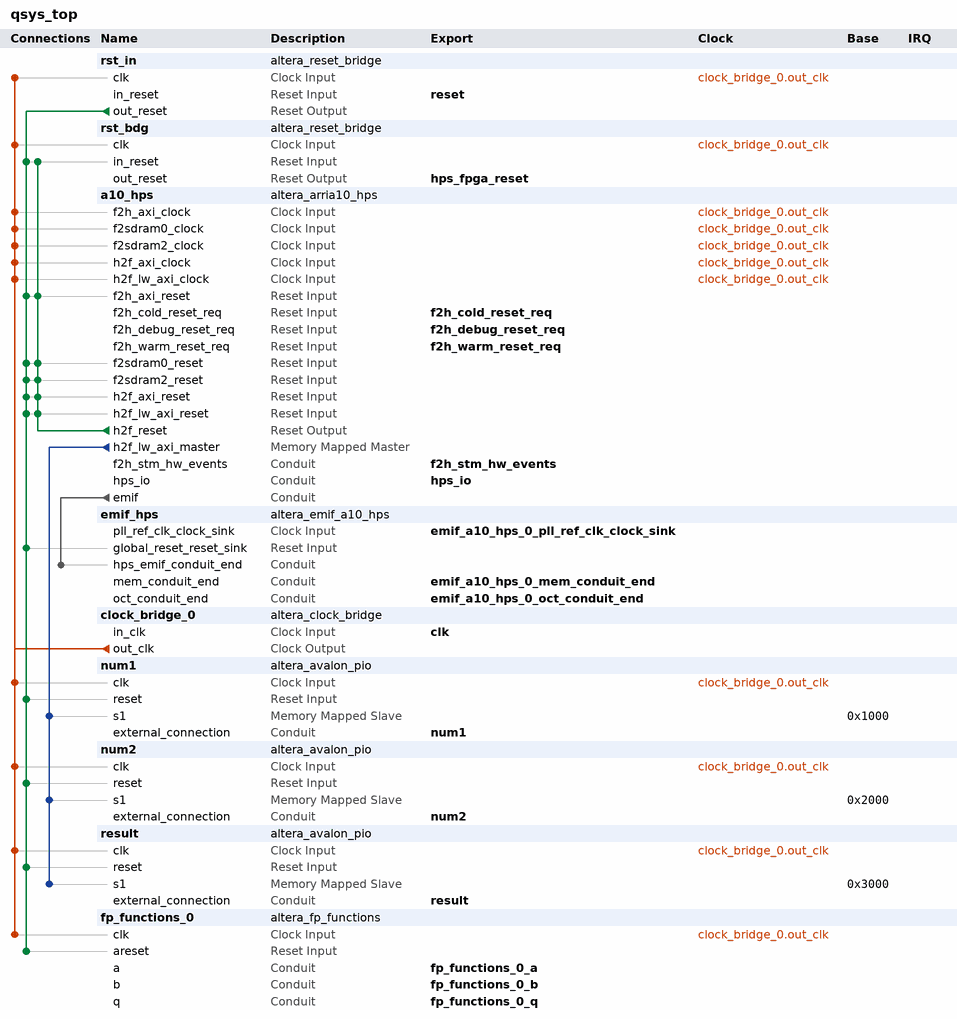
[diagram p0: system contents]
# Platform Designer (Qsys) system qsys_top, Arria 10 10AS066N3F40E2SG
# Parameters at their usual value, and those the tool derives, are not listed.
package require -exact qsys 1.0
create_system qsys_top
set_project_property DEVICE_FAMILY {Arria 10}
set_project_property DEVICE 10AS066N3F40E2SG

add_component rst_in ip/qsys_top/rst_in.ip altera_reset_bridge rst_in 18.1
load_component rst_in
set_component_parameter_value ACTIVE_LOW_RESET 1
set_component_parameter_value SYNCHRONOUS_EDGES deassert
set_component_parameter_value SYNC_RESET 0
save_component

add_component rst_bdg ip/qsys_top/rst_bdg.ip altera_reset_bridge rst_bdg 18.1

add_instance a10_hps altera_arria10_hps 18.1
set_instance_parameter_value a10_hps BOOT_FROM_FPGA_Enable false
set_instance_parameter_value a10_hps BSEL 1
set_instance_parameter_value a10_hps BSEL_EN false
set_instance_parameter_value a10_hps CLK_EMACA_SOURCE 1
set_instance_parameter_value a10_hps CLK_EMACB_SOURCE 1
set_instance_parameter_value a10_hps CLK_EMAC_PTP_SOURCE 1
set_instance_parameter_value a10_hps CLK_GPIO_SOURCE 1
set_instance_parameter_value a10_hps CLK_HMC_PLL_SOURCE 0
set_instance_parameter_value a10_hps CLK_MAIN_PLL_SOURCE2 0
set_instance_parameter_value a10_hps CLK_MPU_CNT 0
set_instance_parameter_value a10_hps CLK_MPU_SOURCE 0
set_instance_parameter_value a10_hps CLK_NOC_CNT 0
set_instance_parameter_value a10_hps CLK_NOC_SOURCE 0
set_instance_parameter_value a10_hps CLK_PERI_PLL_SOURCE2 0
set_instance_parameter_value a10_hps CLK_S2F_USER0_SOURCE 0
set_instance_parameter_value a10_hps CLK_S2F_USER1_SOURCE 0
set_instance_parameter_value a10_hps CLK_SDMMC_SOURCE 1
set_instance_parameter_value a10_hps CM_Mode N/A
set_instance_parameter_value a10_hps CM_PinMuxing Unused
set_instance_parameter_value a10_hps CTI_Enable false
set_instance_parameter_value a10_hps CUSTOM_MPU_CLK 1020
set_instance_parameter_value a10_hps DEBUG_APB_Enable false
set_instance_parameter_value a10_hps DISABLE_PERI_PLL false
set_instance_parameter_value a10_hps DMA_Enable No,No,No,No,No,No,No,No
set_instance_parameter_value a10_hps EMAC0_CLK 250
set_instance_parameter_value a10_hps EMAC0_Mode RGMII_with_MDIO
set_instance_parameter_value a10_hps EMAC0_PTP false
set_instance_parameter_value a10_hps EMAC0_PinMuxing IO
set_instance_parameter_value a10_hps EMAC0_SWITCH_Enable false
set_instance_parameter_value a10_hps EMAC1_CLK 250
set_instance_parameter_value a10_hps EMAC1_Mode N/A
set_instance_parameter_value a10_hps EMAC1_PTP false
set_instance_parameter_value a10_hps EMAC1_PinMuxing Unused
set_instance_parameter_value a10_hps EMAC1_SWITCH_Enable false
set_instance_parameter_value a10_hps EMAC2_CLK 250
set_instance_parameter_value a10_hps EMAC2_Mode N/A
set_instance_parameter_value a10_hps EMAC2_PTP false
set_instance_parameter_value a10_hps EMAC2_PinMuxing Unused
set_instance_parameter_value a10_hps EMAC2_SWITCH_Enable false
set_instance_parameter_value a10_hps EMAC_PTP_REF_CLK 100
set_instance_parameter_value a10_hps EMIF_BYPASS_CHECK false
set_instance_parameter_value a10_hps EMIF_CONDUIT_Enable true
set_instance_parameter_value a10_hps F2H_AXI_CLOCK_FREQ 150000000
set_instance_parameter_value a10_hps F2H_COLD_RST_Enable true
set_instance_parameter_value a10_hps F2H_DBG_RST_Enable true
set_instance_parameter_value a10_hps F2H_DELAY 3
set_instance_parameter_value a10_hps F2H_FREE_CLK_Enable false
set_instance_parameter_value a10_hps F2H_FREE_CLK_FREQ 200
set_instance_parameter_value a10_hps F2H_SDRAM0_CLOCK_FREQ 100
set_instance_parameter_value a10_hps F2H_SDRAM1_CLOCK_FREQ 100
set_instance_parameter_value a10_hps F2H_SDRAM2_CLOCK_FREQ 100
set_instance_parameter_value a10_hps F2H_SDRAM3_CLOCK_FREQ 100
set_instance_parameter_value a10_hps F2H_SDRAM4_CLOCK_FREQ 100
set_instance_parameter_value a10_hps F2H_SDRAM5_CLOCK_FREQ 100
set_instance_parameter_value a10_hps F2H_WARM_RST_Enable true
set_instance_parameter_value a10_hps F2SDRAM0_ENABLED true
set_instance_parameter_value a10_hps F2SDRAM1_ENABLED false
set_instance_parameter_value a10_hps F2SDRAM2_DELAY 4
set_instance_parameter_value a10_hps F2SDRAM2_ENABLED true
set_instance_parameter_value a10_hps F2SDRAM_ADDRESS_WIDTH 32
set_instance_parameter_value a10_hps F2SDRAM_PORT_CONFIG 6
set_instance_parameter_value a10_hps F2SDRAM_READY_LATENCY true
set_instance_parameter_value a10_hps F2SINTERRUPT_Enable true
set_instance_parameter_value a10_hps F2S_Width 6
set_instance_parameter_value a10_hps FPGA_PERIPHERAL_INPUT_CLOCK_FREQ_EMAC0_RX_CLK_IN 100
set_instance_parameter_value a10_hps FPGA_PERIPHERAL_INPUT_CLOCK_FREQ_EMAC0_TX_CLK_IN 100
set_instance_parameter_value a10_hps FPGA_PERIPHERAL_INPUT_CLOCK_FREQ_EMAC1_RX_CLK_IN 100
set_instance_parameter_value a10_hps FPGA_PERIPHERAL_INPUT_CLOCK_FREQ_EMAC1_TX_CLK_IN 100
set_instance_parameter_value a10_hps FPGA_PERIPHERAL_INPUT_CLOCK_FREQ_EMAC2_RX_CLK_IN 100
set_instance_parameter_value a10_hps FPGA_PERIPHERAL_INPUT_CLOCK_FREQ_EMAC2_TX_CLK_IN 100
set_instance_parameter_value a10_hps FPGA_PERIPHERAL_INPUT_CLOCK_FREQ_EMAC_PTP_REF_CLOCK 100
set_instance_parameter_value a10_hps FPGA_PERIPHERAL_INPUT_CLOCK_FREQ_I2C0_SCL_IN 100
set_instance_parameter_value a10_hps FPGA_PERIPHERAL_INPUT_CLOCK_FREQ_I2C1_SCL_IN 100
set_instance_parameter_value a10_hps FPGA_PERIPHERAL_INPUT_CLOCK_FREQ_I2CEMAC0_SCL_IN 100
set_instance_parameter_value a10_hps FPGA_PERIPHERAL_INPUT_CLOCK_FREQ_I2CEMAC1_SCL_IN 100
set_instance_parameter_value a10_hps FPGA_PERIPHERAL_INPUT_CLOCK_FREQ_I2CEMAC2_SCL_IN 100
set_instance_parameter_value a10_hps FPGA_PERIPHERAL_INPUT_CLOCK_FREQ_SDMMC_CLK_IN 100
set_instance_parameter_value a10_hps FPGA_PERIPHERAL_INPUT_CLOCK_FREQ_SPIS0_SCLK_IN 100
set_instance_parameter_value a10_hps FPGA_PERIPHERAL_INPUT_CLOCK_FREQ_SPIS1_SCLK_IN 100
set_instance_parameter_value a10_hps FPGA_PERIPHERAL_INPUT_CLOCK_FREQ_USB0_CLK_IN 100
set_instance_parameter_value a10_hps FPGA_PERIPHERAL_INPUT_CLOCK_FREQ_USB1_CLK_IN 100
set_instance_parameter_value a10_hps FPGA_PERIPHERAL_OUTPUT_CLOCK_FREQ_EMAC0_GTX_CLK 100
set_instance_parameter_value a10_hps FPGA_PERIPHERAL_OUTPUT_CLOCK_FREQ_EMAC0_MD_CLK 2.5
set_instance_parameter_value a10_hps FPGA_PERIPHERAL_OUTPUT_CLOCK_FREQ_EMAC1_GTX_CLK 125
set_instance_parameter_value a10_hps FPGA_PERIPHERAL_OUTPUT_CLOCK_FREQ_EMAC1_MD_CLK 2.5
set_instance_parameter_value a10_hps FPGA_PERIPHERAL_OUTPUT_CLOCK_FREQ_EMAC2_GTX_CLK 125
set_instance_parameter_value a10_hps FPGA_PERIPHERAL_OUTPUT_CLOCK_FREQ_EMAC2_MD_CLK 2.5
set_instance_parameter_value a10_hps FPGA_PERIPHERAL_OUTPUT_CLOCK_FREQ_I2C0_CLK 100
set_instance_parameter_value a10_hps FPGA_PERIPHERAL_OUTPUT_CLOCK_FREQ_I2C1_CLK 100
set_instance_parameter_value a10_hps FPGA_PERIPHERAL_OUTPUT_CLOCK_FREQ_I2CEMAC0_CLK 100
set_instance_parameter_value a10_hps FPGA_PERIPHERAL_OUTPUT_CLOCK_FREQ_I2CEMAC1_CLK 100
set_instance_parameter_value a10_hps FPGA_PERIPHERAL_OUTPUT_CLOCK_FREQ_I2CEMAC2_CLK 100
set_instance_parameter_value a10_hps FPGA_PERIPHERAL_OUTPUT_CLOCK_FREQ_QSPI_SCLK_OUT 100
set_instance_parameter_value a10_hps FPGA_PERIPHERAL_OUTPUT_CLOCK_FREQ_SDMMC_CCLK 100
set_instance_parameter_value a10_hps FPGA_PERIPHERAL_OUTPUT_CLOCK_FREQ_SPIM0_SCLK_OUT 100
set_instance_parameter_value a10_hps FPGA_PERIPHERAL_OUTPUT_CLOCK_FREQ_SPIM1_SCLK_OUT 100
set_instance_parameter_value a10_hps GPIO_REF_CLK 4
set_instance_parameter_value a10_hps GP_Enable false
set_instance_parameter_value a10_hps H2F_AXI_CLOCK_FREQ 150000000
set_instance_parameter_value a10_hps H2F_COLD_RST_Enable false
set_instance_parameter_value a10_hps H2F_CTI_CLOCK_FREQ 100
set_instance_parameter_value a10_hps H2F_DEBUG_APB_CLOCK_FREQ 100
set_instance_parameter_value a10_hps H2F_DELAY 3
set_instance_parameter_value a10_hps H2F_LW_AXI_CLOCK_FREQ 150000000
set_instance_parameter_value a10_hps H2F_LW_DELAY 3
set_instance_parameter_value a10_hps H2F_PENDING_RST_Enable false
set_instance_parameter_value a10_hps H2F_TPIU_CLOCK_IN_FREQ 100
set_instance_parameter_value a10_hps H2F_USER0_CLK_Enable false
set_instance_parameter_value a10_hps H2F_USER0_CLK_FREQ 400
set_instance_parameter_value a10_hps H2F_USER1_CLK_Enable false
set_instance_parameter_value a10_hps H2F_USER1_CLK_FREQ 400
set_instance_parameter_value a10_hps HMC_PLL_REF_CLK 800
set_instance_parameter_value a10_hps HPS_DIV_GPIO_FREQ 125
set_instance_parameter_value a10_hps HPS_IO_Enable SDMMC:D0,SDMMC:CMD,SDMMC:CCLK,SDMMC:D1,SDMMC:D2,SDMMC:D3,NONE,NONE,SDMMC:D4,SDMMC:D5,SDMMC:D6,SDMMC:D7,UART1:TX,UART1:RX,USB0:CLK,USB0:STP,USB0:DIR,USB0:DATA0,USB0:DATA1,USB0:NXT,USB0:DATA2,USB0:DATA3,USB0:DATA4,USB0:DATA5,USB0:DATA6,USB0:DATA7,EMAC0:TX_CLK,EMAC0:TX_CTL,EMAC0:RX_CLK,EMAC0:RX_CTL,EMAC0:TXD0,EMAC0:TXD1,EMAC0:RXD0,EMAC0:RXD1,EMAC0:TXD2,EMAC0:TXD3,EMAC0:RXD2,EMAC0:RXD3,SPIM1:CLK,SPIM1:MOSI,SPIM1:MISO,SPIM1:SS0_N,SPIM1:SS1_N,GPIO,NONE,NONE,NONE,NONE,MDIO0:MDIO,MDIO0:MDC,I2C1:SDA,I2C1:SCL,GPIO,TRACE:CLK,GPIO,GPIO,NONE,NONE,TRACE:D0,TRACE:D1,TRACE:D2,TRACE:D3
set_instance_parameter_value a10_hps I2C0_Mode N/A
set_instance_parameter_value a10_hps I2C0_PinMuxing Unused
set_instance_parameter_value a10_hps I2C1_Mode default
set_instance_parameter_value a10_hps I2C1_PinMuxing IO
set_instance_parameter_value a10_hps I2CEMAC0_Mode N/A
set_instance_parameter_value a10_hps I2CEMAC0_PinMuxing Unused
set_instance_parameter_value a10_hps I2CEMAC1_Mode N/A
set_instance_parameter_value a10_hps I2CEMAC1_PinMuxing Unused
set_instance_parameter_value a10_hps I2CEMAC2_Mode N/A
set_instance_parameter_value a10_hps I2CEMAC2_PinMuxing Unused
set_instance_parameter_value a10_hps INTERNAL_OSCILLATOR_ENABLE 60
set_instance_parameter_value a10_hps JTAG_Enable false
set_instance_parameter_value a10_hps L3_MAIN_FREE_CLK 200
set_instance_parameter_value a10_hps L4_SYS_FREE_CLK 1
set_instance_parameter_value a10_hps LWH2F_Enable 2
set_instance_parameter_value a10_hps MPU_CLK_VCCL 1
set_instance_parameter_value a10_hps MPU_EVENTS_Enable false
set_instance_parameter_value a10_hps NAND_Mode N/A
set_instance_parameter_value a10_hps NAND_PinMuxing Unused
set_instance_parameter_value a10_hps NOCDIV_CS_ATCLK 0
set_instance_parameter_value a10_hps NOCDIV_CS_PDBGCLK 1
set_instance_parameter_value a10_hps NOCDIV_CS_TRACECLK 1
set_instance_parameter_value a10_hps NOCDIV_L4MAINCLK 0
set_instance_parameter_value a10_hps NOCDIV_L4MPCLK 0
set_instance_parameter_value a10_hps NOCDIV_L4SPCLK 2
set_instance_parameter_value a10_hps OVERIDE_PERI_PLL false
set_instance_parameter_value a10_hps PERI_PLL_MANUAL_VCO_FREQ 2000
set_instance_parameter_value a10_hps PLL_CLK0 Unused
set_instance_parameter_value a10_hps PLL_CLK1 Unused
set_instance_parameter_value a10_hps PLL_CLK2 Unused
set_instance_parameter_value a10_hps PLL_CLK3 Unused
set_instance_parameter_value a10_hps PLL_CLK4 Unused
set_instance_parameter_value a10_hps QSPI_Mode N/A
set_instance_parameter_value a10_hps QSPI_PinMuxing Unused
set_instance_parameter_value a10_hps RUN_INTERNAL_BUILD_CHECKS 0
set_instance_parameter_value a10_hps S2FINTERRUPT_CLOCKPERIPHERAL_Enable false
set_instance_parameter_value a10_hps S2FINTERRUPT_CTI_Enable false
set_instance_parameter_value a10_hps S2FINTERRUPT_DMA_Enable false
set_instance_parameter_value a10_hps S2FINTERRUPT_EMAC0_Enable false
set_instance_parameter_value a10_hps S2FINTERRUPT_EMAC1_Enable false
set_instance_parameter_value a10_hps S2FINTERRUPT_EMAC2_Enable false
set_instance_parameter_value a10_hps S2FINTERRUPT_FPGAMANAGER_Enable false
set_instance_parameter_value a10_hps S2FINTERRUPT_GPIO_Enable false
set_instance_parameter_value a10_hps S2FINTERRUPT_HMC_Enable false
set_instance_parameter_value a10_hps S2FINTERRUPT_I2C0_Enable false
set_instance_parameter_value a10_hps S2FINTERRUPT_I2C1_Enable false
set_instance_parameter_value a10_hps S2FINTERRUPT_I2CEMAC0_Enable false
set_instance_parameter_value a10_hps S2FINTERRUPT_I2CEMAC1_Enable false
set_instance_parameter_value a10_hps S2FINTERRUPT_I2CEMAC2_Enable false
set_instance_parameter_value a10_hps S2FINTERRUPT_L4TIMER_Enable false
set_instance_parameter_value a10_hps S2FINTERRUPT_NAND_Enable false
set_instance_parameter_value a10_hps S2FINTERRUPT_QSPI_Enable false
set_instance_parameter_value a10_hps S2FINTERRUPT_SDMMC_Enable false
set_instance_parameter_value a10_hps S2FINTERRUPT_SPIM0_Enable false
set_instance_parameter_value a10_hps S2FINTERRUPT_SPIM1_Enable false
set_instance_parameter_value a10_hps S2FINTERRUPT_SPIS0_Enable false
set_instance_parameter_value a10_hps S2FINTERRUPT_SPIS1_Enable false
set_instance_parameter_value a10_hps S2FINTERRUPT_SYSTEMMANAGER_Enable false
set_instance_parameter_value a10_hps S2FINTERRUPT_SYSTIMER_Enable false
set_instance_parameter_value a10_hps S2FINTERRUPT_UART0_Enable false
set_instance_parameter_value a10_hps S2FINTERRUPT_UART1_Enable false
set_instance_parameter_value a10_hps S2FINTERRUPT_USB0_Enable false
set_instance_parameter_value a10_hps S2FINTERRUPT_USB1_Enable false
set_instance_parameter_value a10_hps S2FINTERRUPT_WATCHDOG_Enable false
set_instance_parameter_value a10_hps S2F_Width 4
set_instance_parameter_value a10_hps SDMMC_Mode 8-bit
set_instance_parameter_value a10_hps SDMMC_PinMuxing IO
set_instance_parameter_value a10_hps SDMMC_REF_CLK 200
set_instance_parameter_value a10_hps SECURITY_MODULE_Enable false
set_instance_parameter_value a10_hps SPIM0_Mode N/A
set_instance_parameter_value a10_hps SPIM0_PinMuxing Unused
set_instance_parameter_value a10_hps SPIM1_Mode Dual_slave_selects
set_instance_parameter_value a10_hps SPIM1_PinMuxing IO
set_instance_parameter_value a10_hps SPIS0_Mode N/A
set_instance_parameter_value a10_hps SPIS0_PinMuxing Unused
set_instance_parameter_value a10_hps SPIS1_Mode N/A
set_instance_parameter_value a10_hps SPIS1_PinMuxing Unused
set_instance_parameter_value a10_hps STM_Enable true
set_instance_parameter_value a10_hps TESTIOCTRL_DEBUGCLKSEL 16
set_instance_parameter_value a10_hps TESTIOCTRL_MAINCLKSEL 8
set_instance_parameter_value a10_hps TESTIOCTRL_PERICLKSEL 8
set_instance_parameter_value a10_hps TEST_Enable false
set_instance_parameter_value a10_hps TRACE_Mode default
set_instance_parameter_value a10_hps TRACE_PinMuxing IO
set_instance_parameter_value a10_hps UART0_Mode N/A
set_instance_parameter_value a10_hps UART0_PinMuxing Unused
set_instance_parameter_value a10_hps UART1_Mode No_flow_control
set_instance_parameter_value a10_hps UART1_PinMuxing IO
set_instance_parameter_value a10_hps USB0_Mode default
set_instance_parameter_value a10_hps USB0_PinMuxing IO
set_instance_parameter_value a10_hps USB1_Mode N/A
set_instance_parameter_value a10_hps USB1_PinMuxing Unused
set_instance_parameter_value a10_hps USE_DEFAULT_MPU_CLK false
set_instance_parameter_value a10_hps device_name 10AS066N3F40E2SG
set_instance_parameter_value a10_hps eosc1_clk_mhz 25.0
set_instance_parameter_value a10_hps quartus_ini_hps_ip_boot_from_fpga_ready false
set_instance_parameter_value a10_hps quartus_ini_hps_ip_enable_a10_advanced_options false
set_instance_parameter_value a10_hps quartus_ini_hps_ip_enable_jtag false
set_instance_parameter_value a10_hps quartus_ini_hps_ip_enable_sdmmc_clk_in false
set_instance_parameter_value a10_hps quartus_ini_hps_ip_enable_test_interface false
set_instance_parameter_value a10_hps quartus_ini_hps_ip_overide_f2sdram_delay false
set_instance_parameter_value a10_hps quartus_ini_hps_ip_override_sdmmc_4bit false

add_component emif_hps ip/qsys_top/emif_hps.ip altera_emif_a10_hps emif_hps 18.1

add_component clock_bridge_0 ip/qsys_top/qsys_top_clock_bridge_0.ip altera_clock_bridge clock_bridge_0 18.1

add_component num1 ip/qsys_top/num1.ip altera_avalon_pio num1 18.1
load_component num1
set_component_parameter_value direction Output
set_component_parameter_value width 32
save_component

add_component num2 ip/qsys_top/num1.ip altera_avalon_pio num2 18.1
load_component num2
set_component_parameter_value direction Output
set_component_parameter_value width 32
save_component

add_component result ip/qsys_top/result.ip altera_avalon_pio result 18.1

add_component fp_functions_0 ip/qsys_top/qsys_top_fp_functions_0.ip altera_fp_functions fp_functions_0 18.1
load_component fp_functions_0
set_component_parameter_value FUNCTION_FAMILY ARITH
set_component_parameter_value ARITH_function ADD
set_component_parameter_value CONVERT_function FXP_FP
set_component_parameter_value ALL_function ADD
set_component_parameter_value EXP_LOG_function EXPE
set_component_parameter_value TRIG_function SIN
set_component_parameter_value COMPARE_function MIN
set_component_parameter_value ROOTS_function SQRT
set_component_parameter_value derivedfunction ADD
set_component_parameter_value fp_format single
set_component_parameter_value fp_exp 8
set_component_parameter_value fp_exp_derived 8
set_component_parameter_value fp_man 23
set_component_parameter_value fp_man_derived 23
set_component_parameter_value exponent_width 23
set_component_parameter_value frequency_target 200
set_component_parameter_value latency_target 2
set_component_parameter_value performance_goal frequency
set_component_parameter_value rounding_mode {nearest with tie breaking away from zero}
set_component_parameter_value rounding_mode_derived {nearest with tie breaking to even}
set_component_parameter_value use_rounding_mode true
set_component_parameter_value faithful_rounding false
set_component_parameter_value gen_enable false
set_component_parameter_value divide_type 0
set_component_parameter_value select_signal_enable false
set_component_parameter_value scale_by_pi false
set_component_parameter_value number_of_inputs 2
set_component_parameter_value trig_no_range_reduction false
set_component_parameter_value report_resources_to_xml false
set_component_parameter_value fxpt_width 32
set_component_parameter_value fxpt_fraction 0
set_component_parameter_value fxpt_sign 1
set_component_parameter_value frequency_feedback 0
set_component_parameter_value latency_feedback 3
set_component_parameter_value force_elaborate 0
set_component_parameter_value fp_out_format single
set_component_parameter_value fp_out_exp 8
set_component_parameter_value fp_out_exp_derived 8
set_component_parameter_value fp_out_man 23
set_component_parameter_value fp_out_man_derived 8
set_component_parameter_value fp_in_format single
set_component_parameter_value fp_in_exp 8
set_component_parameter_value fp_in_exp_derived 8
set_component_parameter_value fp_in_man 23
set_component_parameter_value fp_in_man_derived 8
set_component_parameter_value enable_hard_fp true
set_component_parameter_value manual_dsp_planning true
set_component_parameter_value forceRegisters 1111
set_component_parameter_value RES_DSP_param 2
set_component_parameter_value RES_LUT_param 0
set_component_parameter_value RES_MBIT_param 0
set_component_parameter_value RES_MBLOCK_param 0
set_component_parameter_value selected_device_family {Arria 10}
set_component_parameter_value selected_device_speedgrade 2
set_component_parameter_value validation_failed false
save_component

# connections
add_connection clock_bridge_0.out_clk a10_hps.f2h_axi_clock clock
add_connection clock_bridge_0.out_clk a10_hps.f2sdram0_clock clock
add_connection clock_bridge_0.out_clk a10_hps.f2sdram2_clock clock
add_connection clock_bridge_0.out_clk a10_hps.h2f_axi_clock clock
add_connection clock_bridge_0.out_clk a10_hps.h2f_lw_axi_clock clock
add_connection clock_bridge_0.out_clk fp_functions_0.clk clock
add_connection clock_bridge_0.out_clk num1.clk clock
add_connection clock_bridge_0.out_clk num2.clk clock
add_connection clock_bridge_0.out_clk result.clk clock
add_connection clock_bridge_0.out_clk rst_bdg.clk clock
add_connection clock_bridge_0.out_clk rst_in.clk clock
add_connection a10_hps.h2f_reset a10_hps.f2h_axi_reset reset
add_connection a10_hps.h2f_reset a10_hps.f2sdram0_reset reset
add_connection a10_hps.h2f_reset a10_hps.f2sdram2_reset reset
add_connection a10_hps.h2f_reset a10_hps.h2f_axi_reset reset
add_connection a10_hps.h2f_reset a10_hps.h2f_lw_axi_reset reset
add_connection a10_hps.h2f_reset rst_bdg.in_reset reset
add_connection rst_in.out_reset a10_hps.f2h_axi_reset reset
add_connection rst_in.out_reset a10_hps.f2sdram0_reset reset
add_connection rst_in.out_reset a10_hps.f2sdram2_reset reset
add_connection rst_in.out_reset a10_hps.h2f_axi_reset reset
add_connection rst_in.out_reset a10_hps.h2f_lw_axi_reset reset
add_connection rst_in.out_reset emif_hps.global_reset_reset_sink reset
add_connection rst_in.out_reset fp_functions_0.areset reset
add_connection rst_in.out_reset num1.reset reset
add_connection rst_in.out_reset num2.reset reset
add_connection rst_in.out_reset result.reset reset
add_connection rst_in.out_reset rst_bdg.in_reset reset
add_connection a10_hps.h2f_lw_axi_master num1.s1 avalon
set_connection_parameter_value a10_hps.h2f_lw_axi_master/num1.s1 baseAddress 0x1000
add_connection a10_hps.h2f_lw_axi_master num2.s1 avalon
set_connection_parameter_value a10_hps.h2f_lw_axi_master/num2.s1 baseAddress 0x2000
add_connection a10_hps.h2f_lw_axi_master result.s1 avalon
set_connection_parameter_value a10_hps.h2f_lw_axi_master/result.s1 baseAddress 0x3000
add_connection a10_hps.emif emif_hps.hps_emif_conduit_end conduit

# exported interfaces
add_interface clk clock sink
set_interface_property clk EXPORT_OF clock_bridge_0.in_clk
add_interface emif_a10_hps_0_mem_conduit_end conduit end
set_interface_property emif_a10_hps_0_mem_conduit_end EXPORT_OF emif_hps.mem_conduit_end
add_interface emif_a10_hps_0_oct_conduit_end conduit end
set_interface_property emif_a10_hps_0_oct_conduit_end EXPORT_OF emif_hps.oct_conduit_end
add_interface emif_a10_hps_0_pll_ref_clk_clock_sink clock sink
set_interface_property emif_a10_hps_0_pll_ref_clk_clock_sink EXPORT_OF emif_hps.pll_ref_clk_clock_sink
add_interface f2h_cold_reset_req reset sink
set_interface_property f2h_cold_reset_req EXPORT_OF a10_hps.f2h_cold_reset_req
add_interface f2h_debug_reset_req reset sink
set_interface_property f2h_debug_reset_req EXPORT_OF a10_hps.f2h_debug_reset_req
add_interface f2h_stm_hw_events conduit end
set_interface_property f2h_stm_hw_events EXPORT_OF a10_hps.f2h_stm_hw_events
add_interface f2h_warm_reset_req reset sink
set_interface_property f2h_warm_reset_req EXPORT_OF a10_hps.f2h_warm_reset_req
add_interface fp_functions_0_a conduit end
set_interface_property fp_functions_0_a EXPORT_OF fp_functions_0.a
add_interface fp_functions_0_b conduit end
set_interface_property fp_functions_0_b EXPORT_OF fp_functions_0.b
add_interface fp_functions_0_q conduit end
set_interface_property fp_functions_0_q EXPORT_OF fp_functions_0.q
add_interface hps_fpga_reset reset source
set_interface_property hps_fpga_reset EXPORT_OF rst_bdg.out_reset
add_interface hps_io conduit end
set_interface_property hps_io EXPORT_OF a10_hps.hps_io
add_interface num1 conduit end
set_interface_property num1 EXPORT_OF num1.external_connection
add_interface num2 conduit end
set_interface_property num2 EXPORT_OF num2.external_connection
add_interface reset reset sink
set_interface_property reset EXPORT_OF rst_in.in_reset
add_interface result conduit end
set_interface_property result EXPORT_OF result.external_connection

set_interconnect_requirement {$system} qsys_mm.burstAdapterImplementation GENERIC_CONVERTER
set_interconnect_requirement {$system} qsys_mm.clockCrossingAdapter AUTO
set_interconnect_requirement {$system} qsys_mm.enableEccProtection FALSE
set_interconnect_requirement {$system} qsys_mm.insertDefaultSlave FALSE
set_interconnect_requirement {$system} qsys_mm.maxAdditionalLatency 4
set_interconnect_requirement hps_m.master qsys_mm.security SECURE

save_system qsys_top.qsys
